# EAGLE design 301 Project (EAGLE 9.6.2)
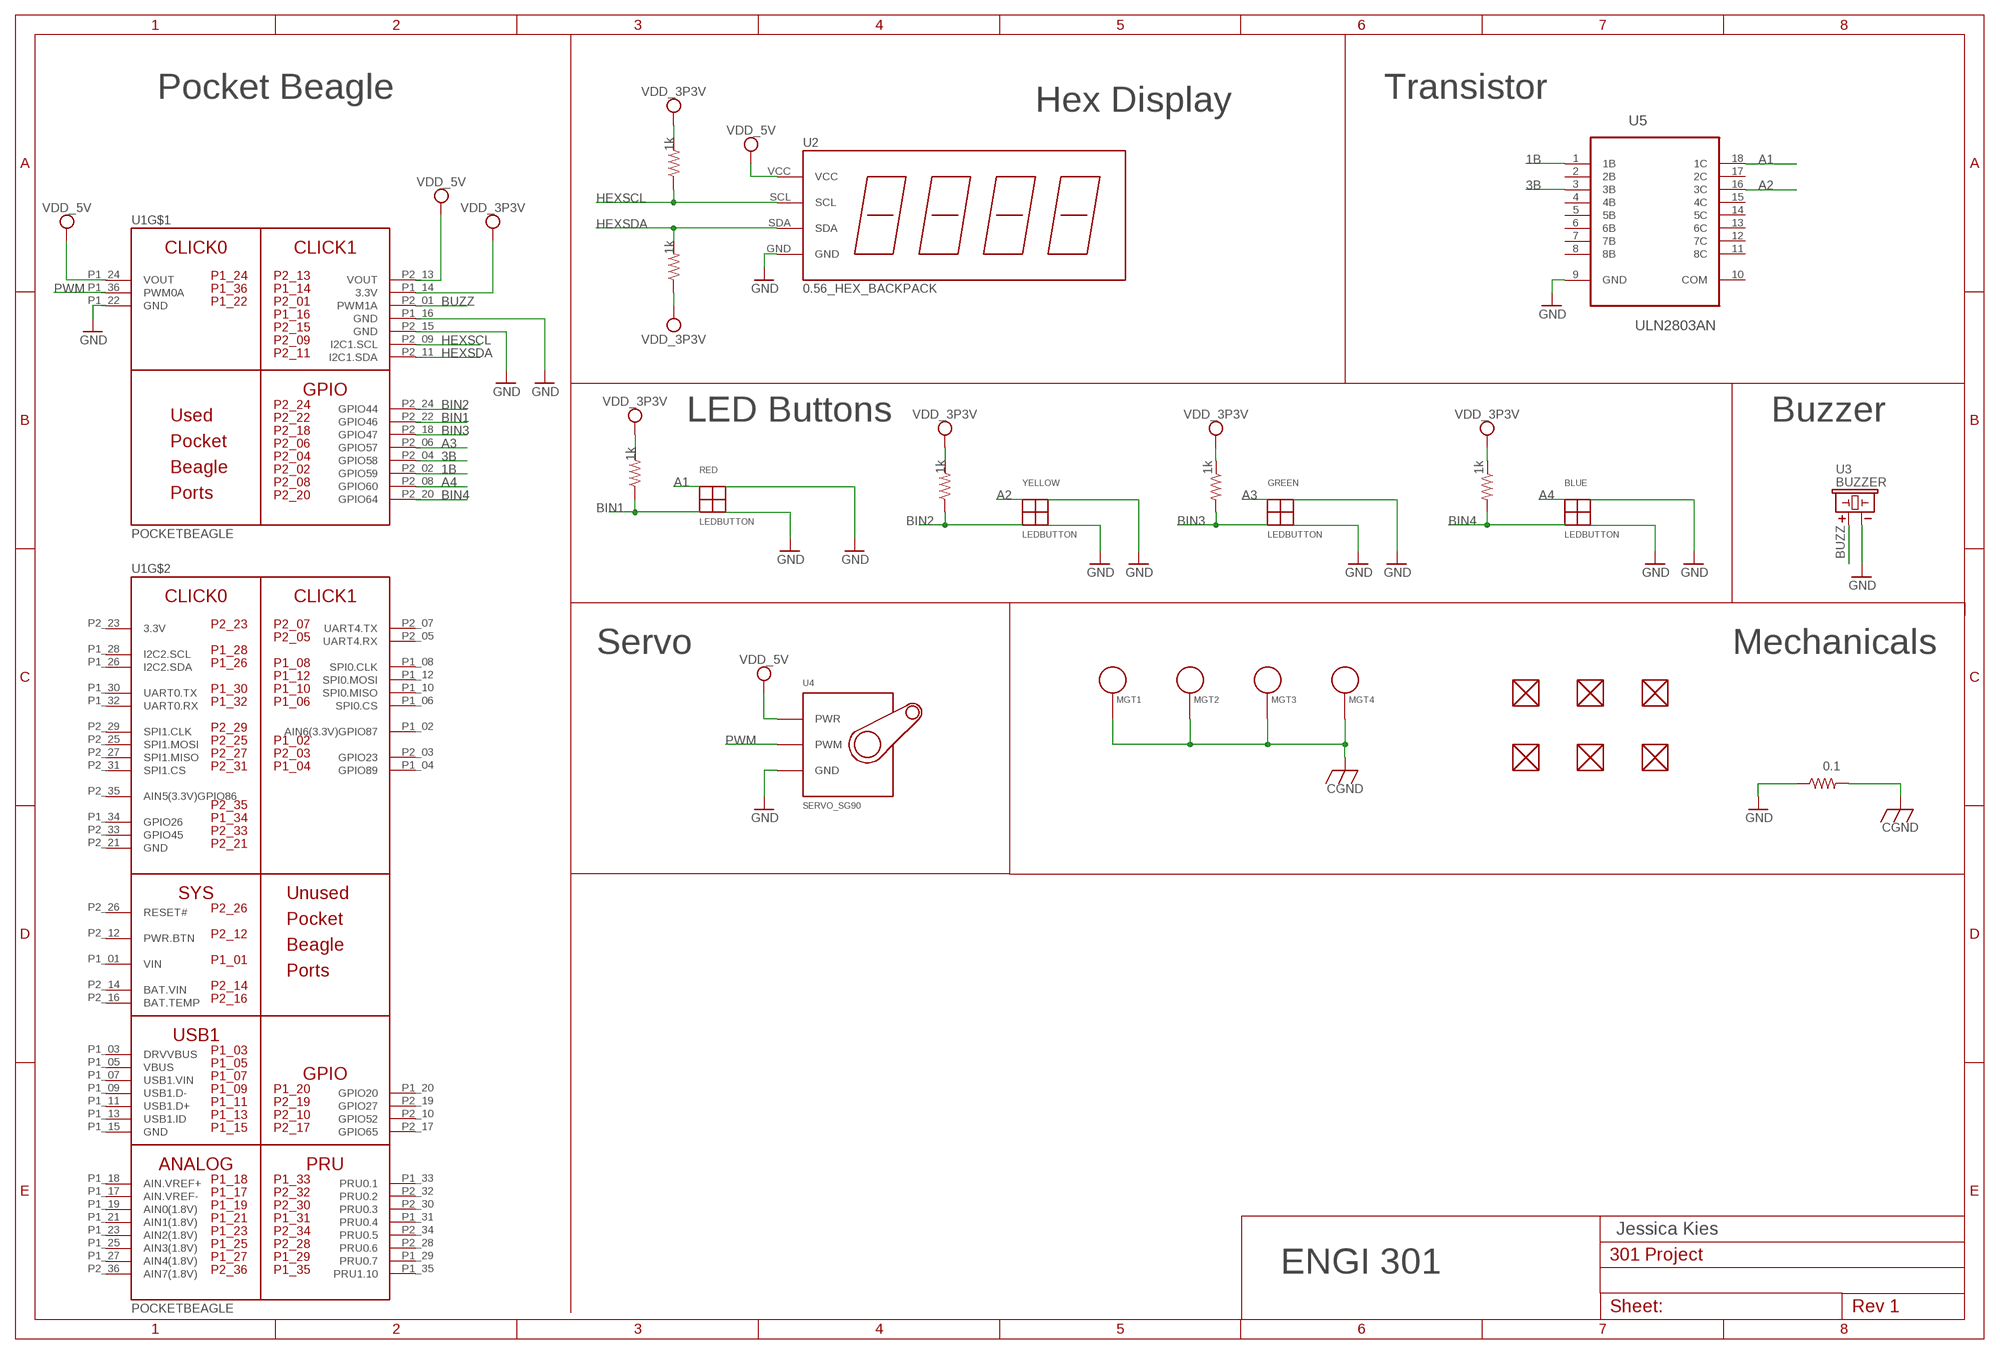
[diagram p0: schematic, sheet 1]

## Parts
BLUE  LEDBUTTON  [LEDBUTTON]
FUD1  FIDUCIAL  [FIDUCIAL_40MIL]
FUD2  FIDUCIAL  [FIDUCIAL_40MIL]
FUD3  FIDUCIAL  [FIDUCIAL_40MIL]
FUD4  FIDUCIAL  [FIDUCIAL_40MIL]
FUD5  FIDUCIAL  [FIDUCIAL_40MIL]
FUD6  FIDUCIAL  [FIDUCIAL_40MIL]
GREEN  LEDBUTTON  [LEDBUTTON]
MGT1  MOUNTING_HOLE  [MOUNTING_HOLE]
MGT2  MOUNTING_HOLE  [MOUNTING_HOLE]
MGT3  MOUNTING_HOLE  [MOUNTING_HOLE]
MGT4  MOUNTING_HOLE  [MOUNTING_HOLE]
R1  1k  R_R0402  [R0402]
R2  1k  R_R0402  [R0402]
R3  1k  R_R0402  [R0402]
R4  0.1  R_R0402  [R0402]
R7  1k  R_R0402  [R0402]
R8  1k  R_R0402  [R0402]
R9  1k  R_R0402  [R0402]
RED  LEDBUTTON  [LEDBUTTON]
U1  POCKETBEAGLE  [POCKETBEAGLE]
U2  0.56_HEX_BACKPACK  [0.56_HEX_BACKPACK]
U3  BUZZER  [BUZZER_6.5MM]
U4  SERVO_SG90  [SERVO-X1]
U5  ULN2803AN  [DIP254P762X393-18]
YELLOW  LEDBUTTON  [LEDBUTTON]

## Nets
1B: U1.P2_02(GPIO59) U5.1(1B)
3B: U1.P2_04(GPIO58) U5.3(3B)
A1: RED.ANODE U5.18(1C)
A2: U5.16(3C) YELLOW.ANODE
A3: GREEN.ANODE U1.P2_06(GPIO57)
A4: BLUE.ANODE U1.P2_08(GPIO60)
BIN1: R3.1 RED.BIN U1.P2_22(GPIO46)
BIN2: R7.1 U1.P2_24(GPIO44) YELLOW.BIN
BIN3: GREEN.BIN R2.2 U1.P2_18(GPIO47)
BIN4: BLUE.BIN R1.2 U1.P2_20(GPIO64)
BUZZ: U1.P2_01(PWM1A) U3.+
CGND: MGT1.P$1 MGT2.P$1 MGT3.P$1 MGT4.P$1 R4.2
GND: BLUE.BOUT BLUE.CATHODE GREEN.BOUT GREEN.CATHODE R4.1 RED.BOUT RED.CATHODE U1.P1_16(GND) U1.P1_22(GND) U1.P2_15(GND) U2.GND U3.- U4.GND U5.9(GND) YELLOW.BOUT YELLOW.CATHODE
HEXSCL: R8.1 U1.P2_09(I2C1.SCL) U2.SCL
HEXSDA: R9.2 U1.P2_11(I2C1.SDA) U2.SDA
PWM: U1.P1_36(PWM0A) U4.SIG(PWM)
VDD_3P3V: R1.1 R2.1 R3.2 R7.2 R8.2 R9.1 U1.P1_14(3.3V)
VDD_5V: U1.P1_24(VOUT) U1.P2_13(VOUT) U2.VCC U4.PWR
Unconnected: FUD1.P$1 FUD2.P$1 FUD3.P$1 FUD4.P$1 FUD5.P$1 FUD6.P$1 U1.P1_02(AIN6(3.3V)GPIO87) U1.P1_03(DRVVBUS) U1.P1_04(GPIO89) U1.P1_05(VBUS) U1.P1_06(SPI0.CS) U1.P1_07(USB1.VIN) U1.P1_08(SPI0.CLK) U1.P1_09(USB1.D-) U1.P1_10(SPI0.MISO) U1.P1_11(USB1.D+) U1.P1_12(SPI0.MOSI) U1.P1_13(USB1.ID) U1.P1_15(GND) U1.P1_17(AIN.VREF-) U1.P1_18(AIN.VREF+) U1.P1_19(AIN0(1.8V)) U1.P1_20(GPIO20) U1.P1_21(AIN1(1.8V)) U1.P1_23(AIN2(1.8V)) U1.P1_25(AIN3(1.8V)) U1.P1_26(I2C2.SDA) U1.P1_27(AIN4(1.8V)) U1.P1_28(I2C2.SCL) U1.P1_29(PRU0.7) U1.P1_30(UART0.TX) U1.P1_31(PRU0.4) U1.P1_32(UART0.RX) U1.P1_33(PRU0.1) U1.P1_34(GPIO26) U1.P1_35(PRU1.10) U1.P2_03(GPIO23) U1.P2_05(UART4.RX) U1.P2_07(UART4.TX) U1.P2_10(GPIO52) U1.P2_12(PWR.BTN) U1.P2_16(BAT.TEMP) U1.P2_17(GPIO65) U1.P2_19(GPIO27) U1.P2_25(SPI1.MOSI) U1.P2_26(RESET#) U1.P2_27(SPI1.MISO) U1.P2_28(PRU0.6) U1.P2_29(SPI1.CLK) U1.P2_30(PRU0.3) U1.P2_31(SPI1.CS) U1.P2_32(PRU0.2) U1.P2_33(GPIO45) U1.P2_34(PRU0.5) U1.P2_35(AIN5(3.3V)GPIO86) U1.P2_36(AIN7(1.8V)) U5.2(2B) U5.4(4B) U5.5(5B) U5.6(6B) U5.7(7B) U5.8(8B) U5.10(COM) U5.11(8C) U5.12(7C) U5.13(6C) U5.14(5C) U5.15(4C) U5.17(2C)

## Notes on the sheet
- Pocket Beagle | Transistor
- Hex Display
- LED Buttons | Buzzer
- Servo | Mechanicals
- Jessica Kies
- ENGI 301

## Power pins joined to a net without a drawn wire
3.3V: U1.P2_23(3.3V)
BAT.VIN: U1.P2_14(BAT.VIN)
GND: U1.P2_21(GND)
VIN: U1.P1_01(VIN)

## Library data of the parts
BLUE GREEN RED YELLOW = MISC:LEDBUTTON
FUD1-FUD6 = MISC:FIDUCIAL
MGT1-MGT4 = MISC:MOUNTING_HOLE: Chassis Mounting Hole w/GND connection ability
R1-R4 R7-R9 = MISC:R_: RESISTOR, American symbol
U1 = MISC:POCKETBEAGLE
U2 = MISC:0.56_HEX_BACKPACK: 0.56" LED HEX Backback - Adafruit HT16K33 - https://www.adafruit.com/product/878 - https://www.adafruit.com/product/879 - https://www.adafruit.com/product/880 - https://www.adafruit.com/product/881 - https://www.adafruit.com/product/1002
U3 = MISC:BUZZER: CEM-1203 Buzzer
U4 = MISC:SERVO_SG90
U5 = MISC:ULN2803AN: Darlington transistor array Check prices <https://pricing.snapeda.com/parts/ULN2803AN/Texas%20Instruments/view-part?ref=eda>; AVAILABILITY: In Stock; DESCRIPTION: Bipolar (BJT) Transistor Array 8 NPN Darlington 50V 500mA - - Through Hole 18-PDIP; MF: Texas Instruments; MP: ULN2803AN; PACKAGE: PDIP-18 Texas Instruments; PRICE: None; PURCHASE-URL: https://pricing.snapeda.com/search/part/ULN2803AN/?ref=eda

## Board
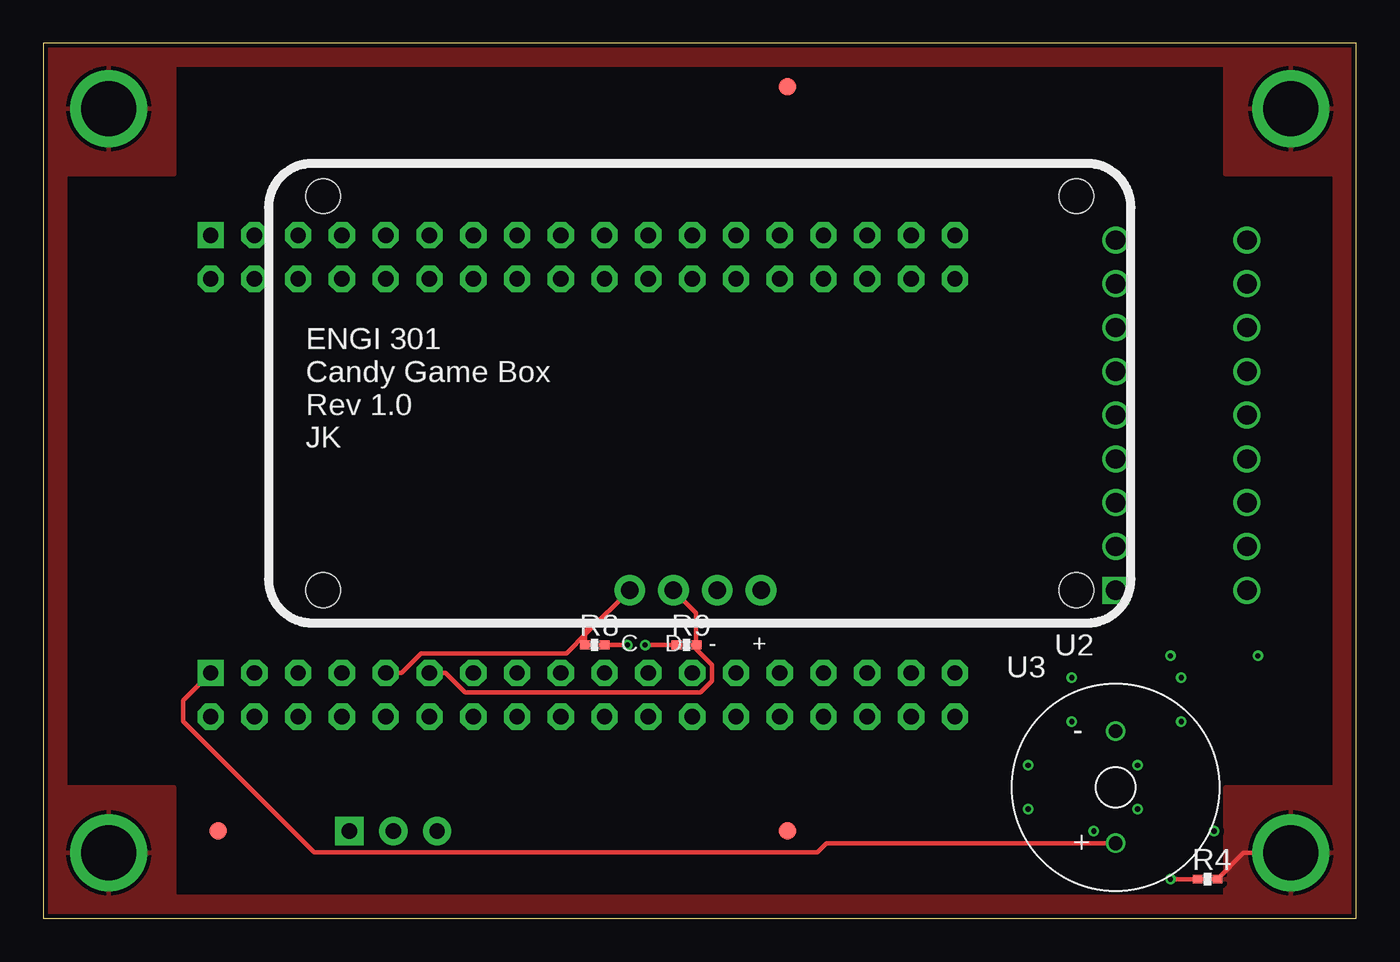
[diagram p1: board, top side]
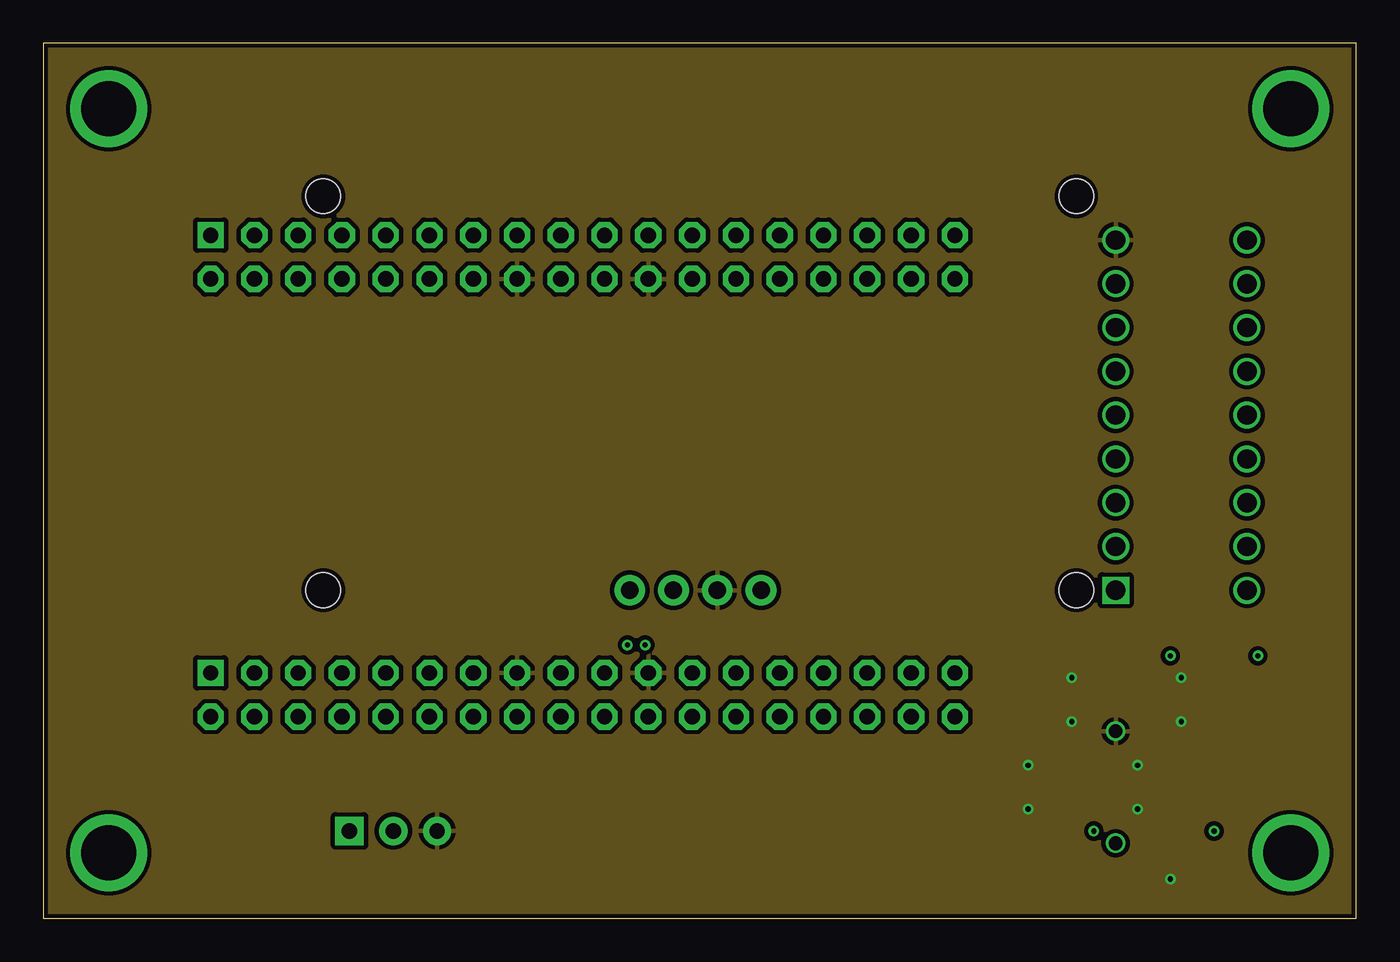
[diagram p2: board, inner layer Route2]
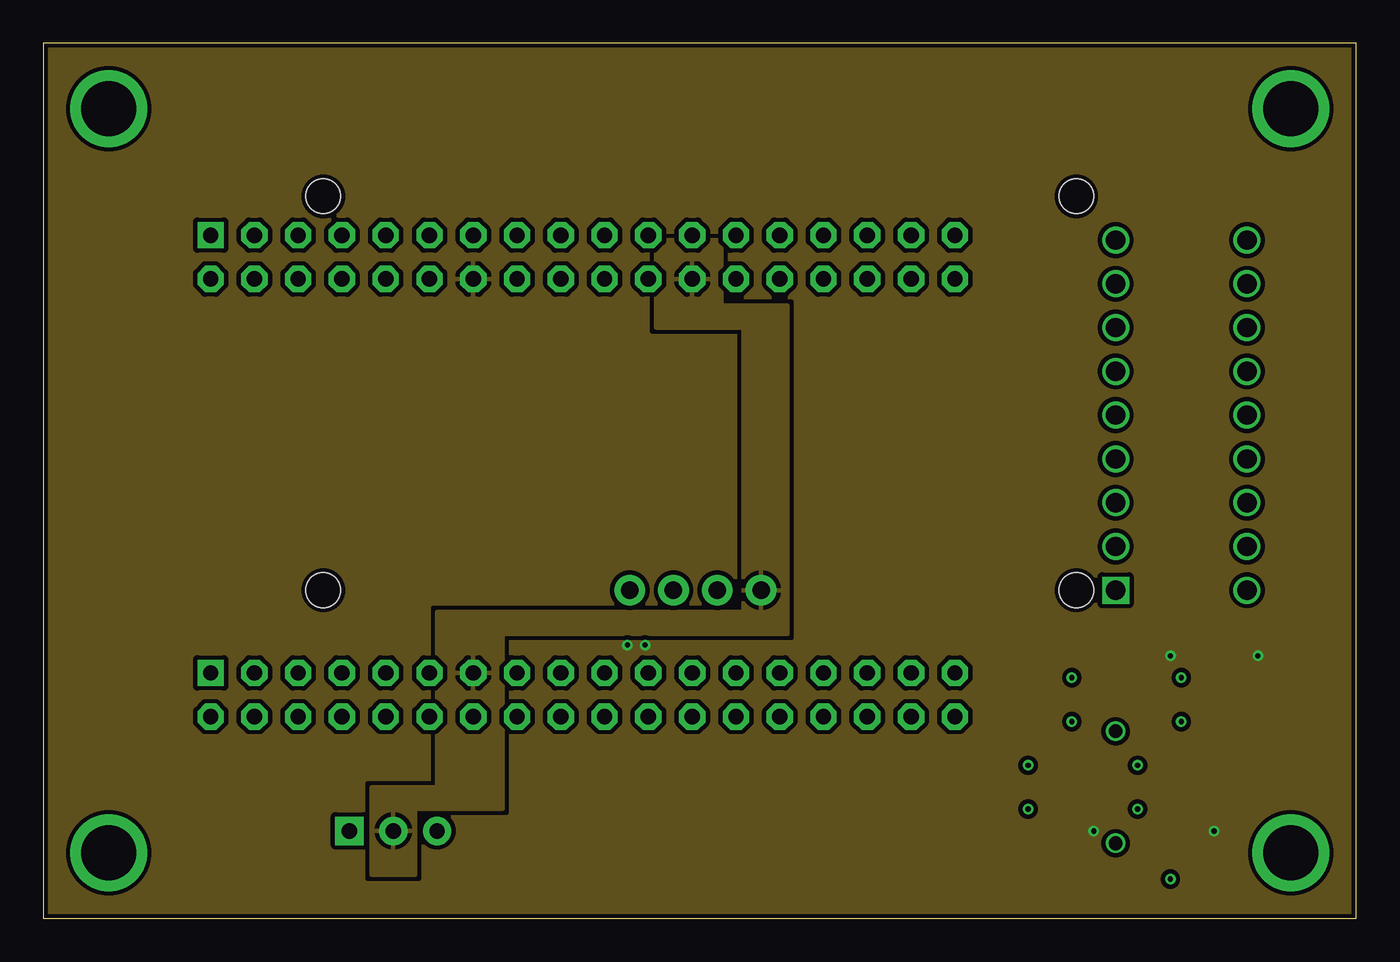
[diagram p3: board, inner layer Route15]
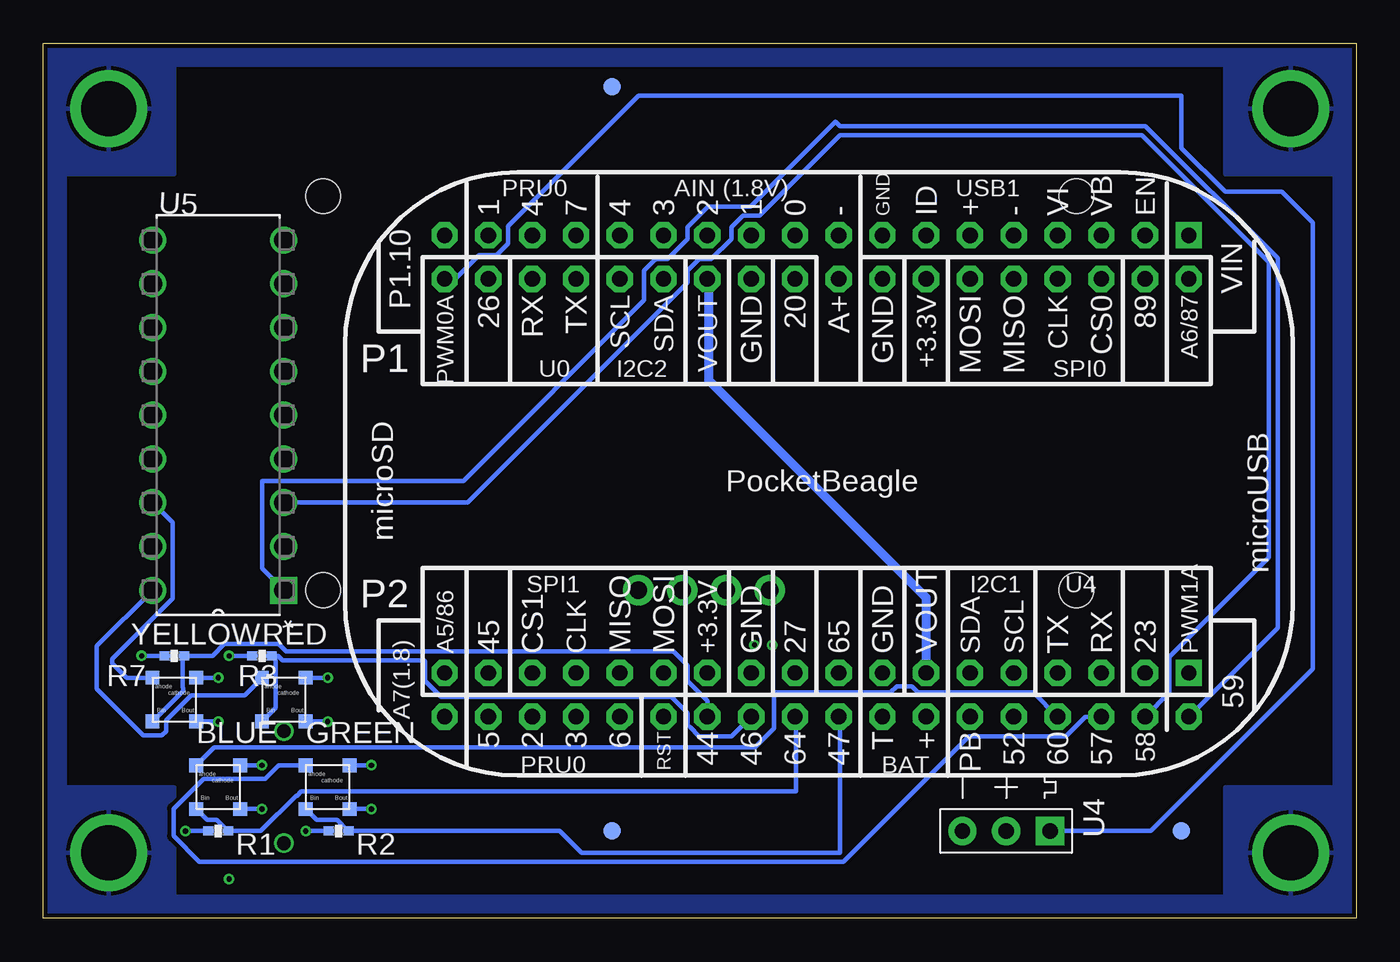
[diagram p4: board, bottom side, seen from below]

Size 76.2 x 50.8 mm. Coordinates in mm from the lower left corner, seen from the top.
Outline: 0,0 76.2,0 76.2,50.8 0,50.8 0,0
Copper layers (1*2*15*16): Top 0.035mm / dielectric 0.23mm / Route2 0.035mm / dielectric 0.93mm / Route15 0.035mm / dielectric 0.23mm / Bottom 0.035mm
Design rules "ENGI301_4lyr": minimum track width 10mil, minimum drill 12mil, track to track 10mil, track to pad 10mil, pad to pad 10mil, via to via 10mil, smd to smd 10mil, copper to edge 10mil, drill to drill 12mil, minimum pad ring 6mil, minimum via ring 6mil, stop-mask expansion 3mil, vias tented up to drill 25mil, thermal gap 10mil

### Footprints (pad centres in the part's own frame; a part is rotated, then mirrored left to right if it is on the bottom)
LEDBUTTON = smd 0.8 x 0.8: ANODE 0,2.54; BIN 0,0; BOUT 2.54,0; CATHODE 2.54,2.54
FIDUCIAL_40MIL = smd 1.016 x 1.016: P$1 0,0
MOUNTING_HOLE = drill 3.175 pad 4.445: P$1 0,0
R0402 = smd 0.61 x 0.508: 1 -0.559,0; 2 0.559,0
POCKETBEAGLE = drill 0.889 pad 1.524 square: P1_01 5.91,3.53; P2_01 5.91,28.93 | drill 0.889 pad 1.524 octagon: P1_02 5.91,6.07; P1_03 8.45,3.53; P1_04 8.45,6.07; P1_05 10.99,3.53; P1_06 10.99,6.07; P1_07 13.53,3.53; P1_08 13.53,6.07; P1_09 16.07,3.53; P1_10 16.07,6.07; P1_11 18.61,3.53; P1_12 18.61,6.07; P1_13 21.15,3.53; P1_14 21.15,6.07; P1_15 23.69,3.53; P1_16 23.69,6.07; P1_17 26.23,3.53; P1_18 26.23,6.07; P1_19 28.77,3.53; P1_20 28.77,6.07; P1_21 31.31,3.53; P1_22 31.31,6.07; P1_23 33.85,3.53; P1_24 33.85,6.07; P1_25 36.39,3.53; P1_26 36.39,6.07; P1_27 38.93,3.53; P1_28 38.93,6.07; P1_29 41.47,3.53; P1_30 41.47,6.07; P1_31 44.01,3.53; P1_32 44.01,6.07; P1_33 46.55,3.53; P1_34 46.55,6.07; P1_35 49.09,3.53; P1_36 49.09,6.07; P2_02 5.91,31.47; P2_03 8.45,28.93; P2_04 8.45,31.47; P2_05 10.99,28.93; P2_06 10.99,31.47; P2_07 13.53,28.93; P2_08 13.53,31.47; P2_09 16.07,28.93; P2_10 16.07,31.47; P2_11 18.61,28.93; P2_12 18.61,31.47; P2_13 21.15,28.93; P2_14 21.15,31.47; P2_15 23.69,28.93; P2_16 23.69,31.47; P2_17 26.23,28.93; P2_18 26.23,31.47; P2_19 28.77,28.93; P2_20 28.77,31.47; P2_21 31.31,28.93; P2_22 31.31,31.47; P2_23 33.85,28.93; P2_24 33.85,31.47; P2_25 36.39,28.93; P2_26 36.39,31.47; P2_27 38.93,28.93; P2_28 38.93,31.47; P2_29 41.47,28.93; P2_30 41.47,31.47; P2_31 44.01,28.93; P2_32 44.01,31.47; P2_33 46.55,28.93; P2_34 46.55,31.47; P2_35 49.09,28.93; P2_36 49.09,31.47
0.56_HEX_BACKPACK = drill 1.016 pad 1.778: GND -1.016,11.43; SCL 4.064,11.43; SDA 1.524,11.43; VCC -3.556,11.43 | hole 2: -21.844,-11.43; 21.844,-11.43; -21.844,11.43; 21.844,11.43
BUZZER_6.5MM = drill 0.8: + 0,-3.25; - 0,3.25
SERVO-X1 = drill 0.889 pad 1.651: GND 0,-2.54; PWR 0,0 | drill 0.889 pad 1.651 square: SIG 0,2.54
DIP254P762X393-18 = drill 1.118 square: 1 -7.62,20.32 | drill 1.118: 2 -7.62,17.78; 3 -7.62,15.24; 4 -7.62,12.7; 5 -7.62,10.16; 6 -7.62,7.62; 7 -7.62,5.08; 8 -7.62,2.54; 9 -7.62,0; 10 0,0; 11 0,2.54; 12 0,5.08; 13 0,7.62; 14 0,10.16; 15 0,12.7; 16 0,15.24; 17 0,17.78; 18 0,20.32

### Placement (x,y rotation side)
BLUE  67.31,6.35 0 bottom
FUD1  10.16,5.08 0 bottom
FUD2  43.18,5.08 0 bottom
FUD3  43.18,48.26 0 bottom
FUD4  43.18,48.26 0 top
FUD5  43.18,5.08 0 top
FUD6  10.16,5.08 0 top
GREEN  60.96,6.35 0 bottom
MGT1  3.81,3.81 187.6 top
MGT2  72.39,3.81 0 top
MGT3  72.39,46.99 0 top
MGT4  3.81,46.99 0 top
R1  66.04,5.08 0 bottom
R2  59.05,5.08 0 bottom
R3  63.5,15.24 180 bottom
R4  67.56,2.29 0 top
R7  68.58,15.24 180 bottom
R8  32,15.88 0 top
R9  37.34,15.88 0 top
RED  63.5,11.43 0 bottom
U1  3.81,43.18 180 bottom
U2  38.1,30.48 180 top
U3  62.23,7.62 0 top
U4  20.32,5.08 270 bottom
U5  69.85,39.37 180 bottom
YELLOW  69.85,11.43 0 bottom

### Tracks (layer width: path | path; a pad name or v marks a point on that pad's centre or on a via)
1B
  Bottom 0.254: U5.1 63.5,20.32 63.5,25.4 51.82,25.4 41.34,35.87 41.34,37.58 40.67,38.25 39.98,38.25 38.8,39.43 38.8,40.12 37.62,41.3 35.15,41.3 30.23,46.23 29.97,45.97 12.24,45.97 4.57,38.31 4.57,16.86 U1.P2_02
3B
  Bottom 0.254: U5.3 51.56,24.13 38.8,36.89 38.8,37.58 38.13,38.25 37.44,38.25 36.26,39.43 36.26,40.12 35.59,40.79 34.65,40.79 29.97,45.47 12.45,45.47 5.08,38.1 5.08,20.95 10.86,15.17 10.86,13.11 U1.P2_04
A1
  Bottom 0.254: U5.18 73.08,15.82 73.08,13.32 70.39,10.63 70.1,10.63 69.31,10.63 69.07,10.87 69.07,11.49 67.61,12.95 64.52,12.95 RED.ANODE
A2
  Bottom 0.254: YELLOW.ANODE 71.35,13.97 72.19,14.81 72.19,15.07 68.69,18.57 68.69,22.97 U5.16
A3
  Bottom 0.254: U1.P2_06 15.72,11.71 16.87,10.57 22.5,10.57 29.76,3.3 67.14,3.3 68.63,4.8 68.63,6.37 66.89,8.11 63.31,8.11 62.53,8.89 GREEN.ANODE
A4
  Bottom 0.254: BLUE.ANODE 66.27,9.93 34.9,9.93 33.78,11.05 33.78,13.11 27.03,13.11 26.67,13.46 25.79,13.46 25.43,13.11 18.74,13.11 U1.P2_08
BIN1
  Bottom 0.254: RED.BIN 62.72,12.21 62.72,15.02 R3.1 62.56,15.24 62.31,14.99 54.1,14.99 54.04,14.93 54.04,13.78 53.12,12.85 39.73,12.85 38.8,11.93 38.8,11.24 38.67,11.11 38.13,10.57 36.26,10.57 U1.P2_22
BIN2
  Bottom 0.254: YELLOW.BIN 68.07,13.21 68.07,13.39 68.09,13.41 68.09,15.17 R7.1 66.38,15.24 65.69,15.93 62.53,15.93 62.1,15.49 39.62,15.49 38.8,14.67 38.8,13.78 37.66,12.63 U1.P2_24
BIN3
  Bottom 0.254: GREEN.BIN 60.33,5.71 59.15,5.71 58.52,5.08 R2.2 46.23,5.08 44.96,3.81 29.97,3.81 29.97,11.64 U1.P2_18
BIN4
  Bottom 0.254: BLUE.BIN 66.67,5.71 66.14,5.71 65.5,5.08 R1.2 63.57,5.08 61.52,7.13 61.45,7.13 61.21,7.37 32.51,7.37 32.51,11.64 U1.P2_20
BUZZ
  Top 0.254: U3.+ 45.47,4.37 44.94,3.84 15.72,3.84 8.13,11.43 8.13,12.66 U1.P2_01
CGND
  Top 0.254: R4.2 69.65,3.81 MGT2.P$1
  pour Top: -1.27,25.4 -1.27,52.07 77.47,52.07 77.47,25.4 74.93,25.4 74.93,43.18 68.58,43.18 68.58,49.53 7.62,49.53 7.62,43.18 1.27,43.18 1.27,25.4
  pour Top: -1.27,25.4 -1.27,-1.27 77.47,-1.27 77.47,25.4 74.93,25.4 74.93,7.62 68.58,7.62 68.58,1.27 7.62,1.27 7.62,7.62 1.27,7.62 1.27,25.4
  pour Bottom: -1.27,25.4 -1.27,52.07 77.47,52.07 77.47,25.4 74.93,25.4 74.93,43.18 68.58,43.18 68.58,49.53 7.62,49.53 7.62,43.18 1.27,43.18 1.27,25.4
  pour Bottom: -1.27,25.4 -1.27,-1.27 77.47,-1.27 77.47,25.4 74.93,25.4 74.93,7.62 68.58,7.62 68.58,1.27 7.62,1.27 7.62,7.62 1.27,7.62 1.27,25.4
GND  (via drill 0.3 pad 0.61)
  Top 0.254: R4.1 v65.41,2.29
  Bottom 0.254: RED.CATHODE v59.69,13.97 | RED.BOUT v59.69,11.43 | GREEN.CATHODE v57.15,8.89 | GREEN.BOUT v57.15,6.35 | BLUE.CATHODE v63.5,8.89 | BLUE.BOUT v63.5,6.35 | YELLOW.CATHODE v66.04,13.97 | YELLOW.BOUT v66.04,11.43
  pour Route2: -2.54,-2.54 -2.54,53.34 78.74,53.34 78.74,-2.54
HEXSCL
  Top 0.254: 31.57,16.59 31.57,16.76 31.45,16.64 R8.1 | U2.SCL 31.57,16.59 | 31.57,16.59 30.38,15.39 21.95,15.39 20.8,14.25 U1.P2_09
HEXSDA
  Top 0.254: U2.SDA 37.9,17.73 37.9,17.53 R9.2 37.9,15.63 38.8,14.72 38.8,13.78 38.13,13.11 24.49,13.11 23.34,14.25 U1.P2_11
PWM
  Bottom 0.254: U4.SIG 11.94,5.08 2.54,14.48 2.54,40.39 4.32,42.16 7.62,42.16 10.16,44.7 10.16,47.75 41.66,47.75 49.22,40.19 49.22,39.18 49.89,38.51 50.9,38.51 52.3,37.11 U1.P1_36
VDD_3P3V  (via drill 0.3 pad 0.61)
  Top 0.254: R8.2 v33.91,15.88 | R9.1 v34.92,15.88
  Bottom 0.254: R2.1 v60.96,5.08 | R1.1 v67.94,5.08 | R3.2 v65.41,15.24 | R7.2 v70.48,15.24
  pour Route15 (rank 6): -5.08,-5.08 -5.08,55.88 81.28,55.88 81.28,-5.08
VDD_5V
  Bottom 0.508: U1.P2_13 24.96,18.61 37.59,31.24 37.59,37.04 U1.P1_24
  pour Route15: 26.67,16.51 22.86,16.51 22.86,7.62 19.05,7.62 19.05,2.54 21.59,2.54 21.59,6.35 26.67,6.35
  pour Route15: 26.67,16.51 43.18,16.51 43.18,35.56 39.37,35.56 39.37,39.37 35.56,39.37 35.56,34.29 40.64,34.29 40.64,17.78 22.86,17.78 22.86,16.51

### Text on the board
tPlace: ENGI 301 / Candy Game Box / Rev 1.0 / JK